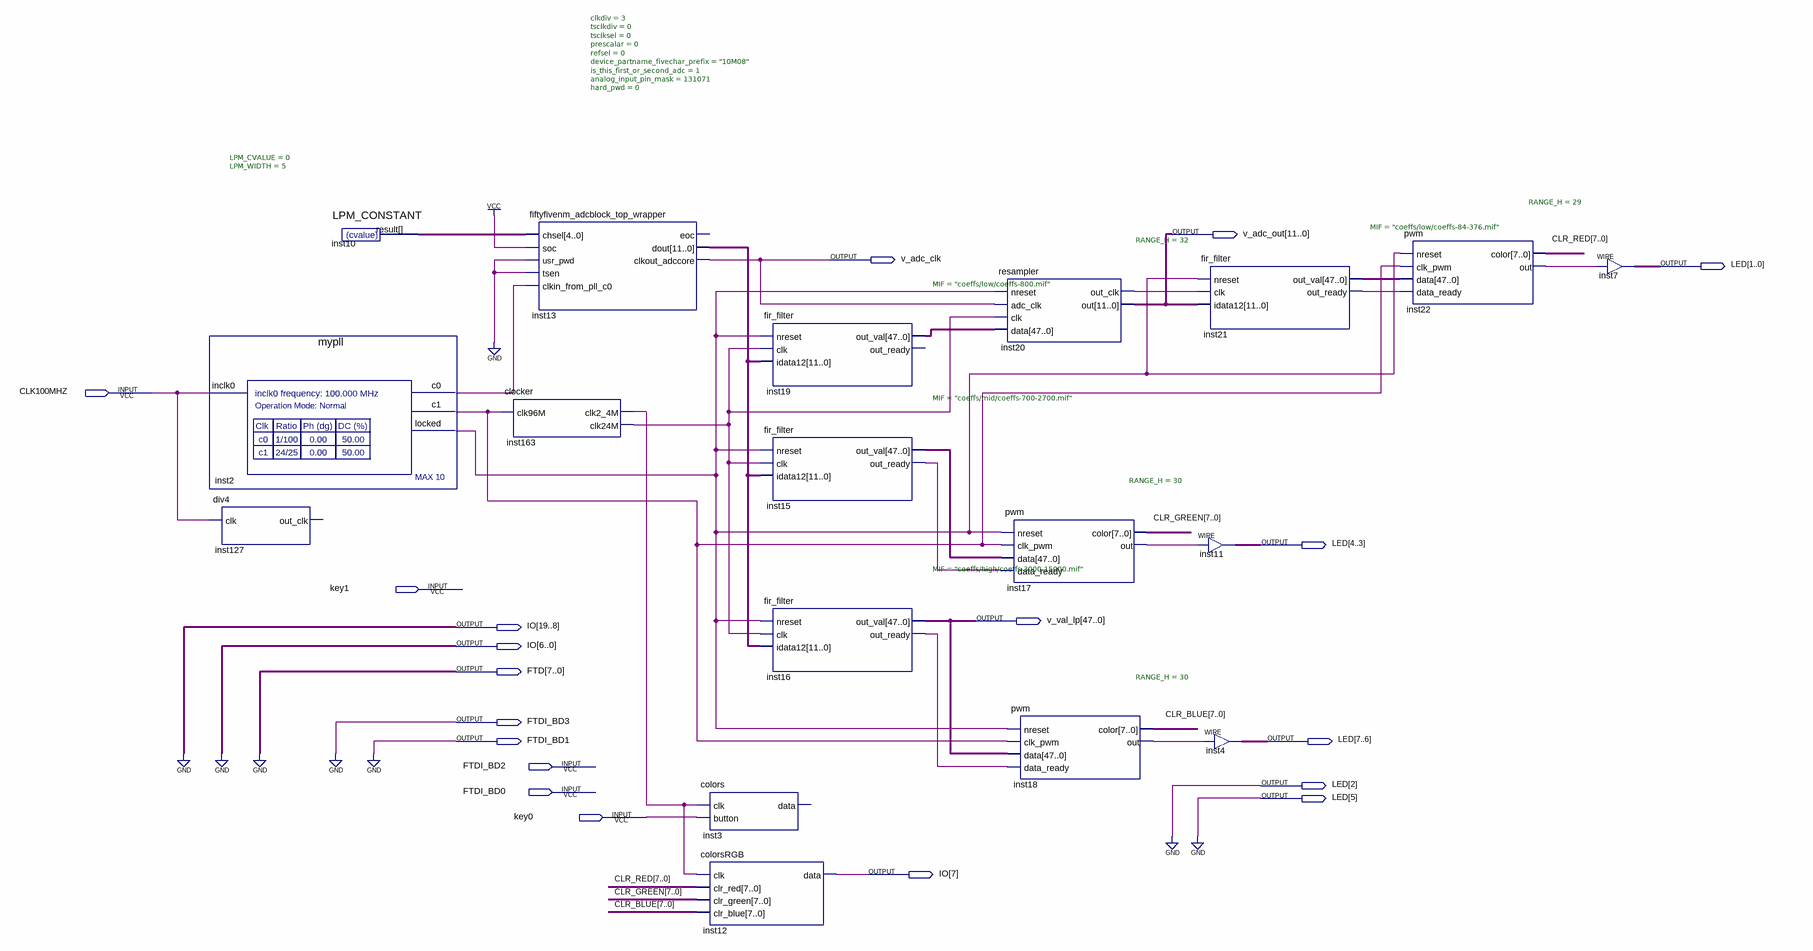
[diagram p0: schematic sheet]
// Quartus schematic max10.bdf as structural Verilog: 18 symbols, 19 pins
module max10 (
  input  CLK100MHZ,
  input  key1,
  input  FTDI_BD2,
  input  FTDI_BD0,
  input  key0,
  output [11:0] v_adc_out,
  output v_adc_clk,
  output [7:0] LED,
  output [47:0] v_val_lp,
  output [19:0] IO,
  output [7:0] FTD,
  output FTDI_BD3,
  output FTDI_BD1
);

  wire inst2_c0, inst2_c1, inst2_locked, inst15_out_ready, inst16_out_ready, inst17_out, inst18_out,
       inst20_out_clk, inst21_out_ready, inst22_out, inst163_clk2_4m, inst163_clk24m;
  wire [4:0] inst10_result;
  wire [7:0] CLR_BLUE, CLR_GREEN, CLR_RED;
  wire [11:0] inst13_dout;
  wire [47:0] inst15_out_val, inst19_out_val, inst21_out_val;

  mypll inst2 (.inclk0(CLK100MHZ), .c0(inst2_c0), .c1(inst2_c1), .locked(inst2_locked));
  div4 inst127 (.clk(CLK100MHZ));  // open: out_clk
  LPM_CONSTANT #(.LPM_CVALUE(0), .LPM_WIDTH(5)) inst10 (.result(inst10_result));
  fiftyfivenm_adcblock_top_wrapper #(.clkdiv(3), .tsclkdiv(0), .tsclksel(0), .prescalar(0), .refsel(0), .device_partname_fivechar_prefix("10M08"), .is_this_first_or_second_adc(1), .analog_input_pin_mask(131071), .hard_pwd(0)) inst13 (
    .chsel(inst10_result), .soc(1'b1), .usr_pwd(1'b0), .tsen(1'b0), .clkin_from_pll_c0(inst2_c0),
    .dout(inst13_dout), .clkout_adccore(v_adc_clk));  // open: eoc
  clocker inst163 (.clk96M(inst2_c1), .clk2_4M(inst163_clk2_4m), .clk24M(inst163_clk24m));
  colors inst3 (.clk(inst163_clk2_4m), .button(key0));  // open: data
  colorsRGB inst12 (.clk(inst163_clk2_4m), .clr_red(CLR_RED), .clr_green(CLR_GREEN), .clr_blue(CLR_BLUE), .data(IO[7]));
  fir_filter #(.MIF("coeffs/low/coeffs-800.mif")) inst19 (
    .nreset(inst2_locked), .clk(inst163_clk24m), .idata12(inst13_dout), .out_val(inst19_out_val));  // open: out_ready
  fir_filter #(.MIF("coeffs/mid/coeffs-700-2700.mif")) inst15 (
    .nreset(inst2_locked), .clk(inst163_clk24m), .idata12(inst13_dout), .out_val(inst15_out_val),
    .out_ready(inst15_out_ready));
  fir_filter #(.MIF("coeffs/high/coeffs-3000-15000.mif")) inst16 (
    .nreset(inst2_locked), .clk(inst163_clk24m), .idata12(inst13_dout), .out_val(v_val_lp),
    .out_ready(inst16_out_ready));
  resampler #(.RANGE_H(32)) inst20 (
    .nreset(inst2_locked), .adc_clk(v_adc_clk), .clk(inst163_clk24m), .data(inst19_out_val),
    .out_clk(inst20_out_clk), .out(v_adc_out));
  pwm #(.RANGE_H(30)) inst17 (
    .nreset(inst2_locked), .clk_pwm(inst2_c1), .data(inst15_out_val), .data_ready(inst15_out_ready),
    .color(CLR_GREEN), .out(inst17_out));
  pwm #(.RANGE_H(30)) inst18 (
    .nreset(inst2_locked), .clk_pwm(inst2_c1), .data(v_val_lp), .data_ready(inst16_out_ready),
    .color(CLR_BLUE), .out(inst18_out));
  fir_filter #(.MIF("coeffs/low/coeffs-84-376.mif")) inst21 (
    .nreset(inst2_locked), .clk(inst20_out_clk), .idata12(v_adc_out), .out_val(inst21_out_val),
    .out_ready(inst21_out_ready));
  assign LED[4:3] = {2{inst17_out}};  // WIRE inst11
  assign LED[7:6] = {2{inst18_out}};  // WIRE inst4
  pwm #(.RANGE_H(29)) inst22 (
    .nreset(inst2_locked), .clk_pwm(inst2_c1), .data(inst21_out_val), .data_ready(inst21_out_ready),
    .color(CLR_RED), .out(inst22_out));
  assign LED[1:0] = {2{inst22_out}};  // WIRE inst7

  assign FTD = {8{1'b0}};
  assign FTDI_BD1 = 1'b0;
  assign FTDI_BD3 = 1'b0;
  assign {IO[19:8], IO[6:0]} = {19{1'b0}};
  assign {LED[5], LED[2]} = 2'b00;
endmodule
